# Altium schematic sheet [02]-STLinkV2_1.SchDoc (part 1 of 3)
size A4; Revision: 1.0; SheetNumber: 2; SheetTotal: 2
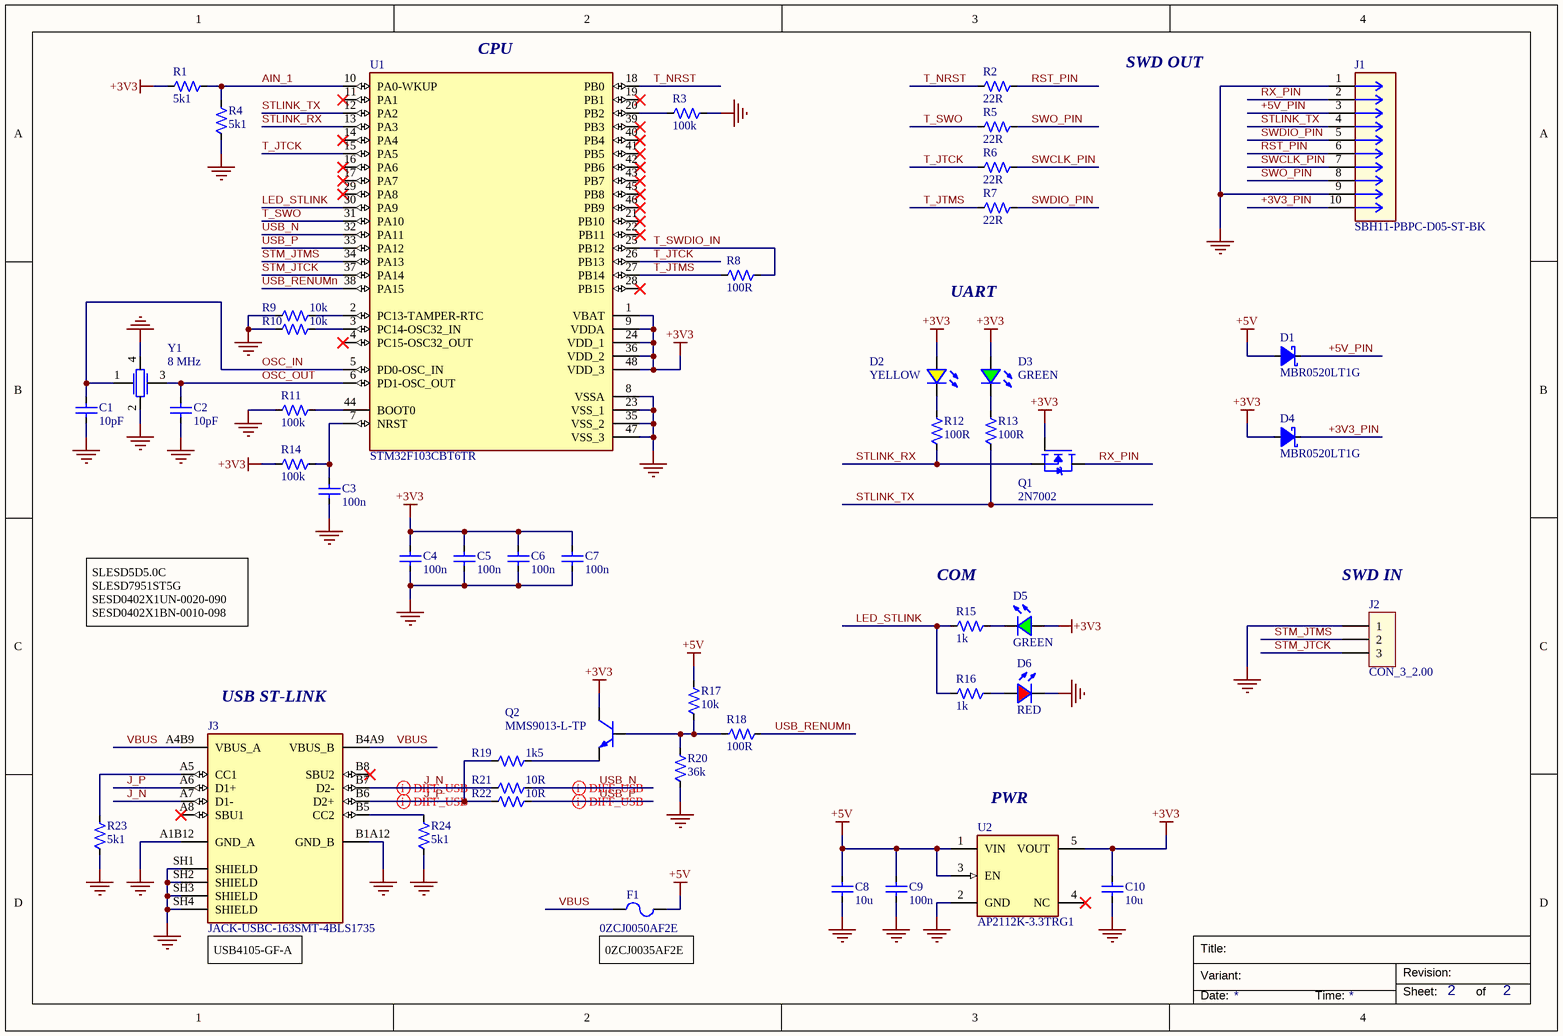
[diagram p0: [02]-STLinkV2_1.SchDoc]

## Parts
C1  10pF  [CAPC1005X55N]
C2  10pF  [CAPC1005X55N]
C3  100n  [CAPC1005X55N]
C4  100n  [CAPC1005X55N]
C5  100n  [CAPC1005X55N]
C6  100n  [CAPC1005X55N]
C7  100n  [CAPC1005X55N]
C8  10u  [CAPC0603(1608Metric)L]
C9  100n  [CAPC1005X55N]
C10  10u  [CAPC0603(1608Metric)L]
D1  MBR0520LT1G  [SOD3716X135N]
D2  YELLOW  [WL-SMCW_0603_150060xx75003]
D3  GREEN  [WL-SMCW_0603_150060xx75003]
D4  MBR0520LT1G  [SOD3716X135N]
D5  GREEN  [WL-SMCW_0603_150060xx75003]
D6  RED
F1  0ZCJ0050AF2E  [0ZCJ_BEL]
J1  SBH11-PBPC-D05-ST-BK  [SULLINS_SBH11-PBPC-D05-ST-BK-H]
J2  CON_3_2.00  [Pin3]  (no BOM)
J3  JACK-USBC-163SMT-4BLS1735  [JACK-USBC-163SMT-4BLS1735]
Q1  2N7002  [SOT23-3]
Q2  MMS9013-L-TP  [SOT23-3]
R1  5k1  [RESC1005X37N]
R2  22R  [RESC1005X37N]
R3  100k  [RESC1005X37N]
R4  5k1  [RESC1005X37N]
R5  22R  [RESC1005X37N]
R6  22R  [RESC1005X37N]
R7  22R  [RESC1005X37N]
R8  100R  [RESC1005X37N]
R9  10k  [RESC1005X37N]
R10  10k  [RESC1005X37N]
R11  100k  [RESC1005X37N]
R12  100R  [RESC1005X37N]
R13  100R  [RESC1005X37N]
R14  100k  [RESC1005X37N]
R15  1k  [RESC1005X37N]
R16  1k  [RESC1005X37N]
R17  10k  [RESC1005X37N]
R18  100R  [RESC1005X37N]
R19  1k5  [RESC1005X37N]
R20  36k  [RESC1005X37N]
R21  10R  [RESC1005X37N]
R22  10R  [RESC1005X37N]
R23  5k1  [RESC1005X37N]
R24  5k1  [RESC1005X37N]
U1  STM32F103CBT6TR  [QFP50P900X900X160-48N]
U2  AP2112K-3.3TRG1  [SOT95P285X140-5N]
Y1  value 8 MHz  [XTAL_C3E-8.000-8-1015-R]  (hidden comment: ECS-80-10-33-CKM-TR3)

## Nets
+3V3: C4.1 C5.1 C6.1 C7.1 C10.2 D2.1(POS) D3.1(POS) D4.1(A) D5.1(POS) Q1.1(G) Q2.3(C) R1.2 R14.2 U1.1(VBAT) U1.9(VDDA) U1.24(VDD_1) U1.36(VDD_2) U1.48(VDD_3) U2.5(VOUT)
+5V: C8.2 C9.1 D1.1(A) F1.2 R17.1 U2.1(VIN) U2.3(EN)
GND: C1.1 C2.1 C3.2 C4.2 C5.2 C6.2 C7.2 C8.1 C9.2 C10.1 D6.2(NEG) J1.1 J1.9 J2.1 J3.A1B12(GND_A) J3.B1A12(GND_B) J3.SH1(SHIELD) J3.SH2(SHIELD) J3.SH3(SHIELD) J3.SH4(SHIELD) R3.1 R4.2 R9.2 R10.2 R11.2 R20.2 R23.2 R24.2 U1.8(VSSA) U1.23(VSS_1) U1.35(VSS_2) U1.47(VSS_3) U2.2(GND) Y1.2(GND) Y1.4(GND)
+3V3_PIN: D4.2(K) J1.10
+5V_PIN: D1.2(K) J1.3
AIN_1: R1.1 R4.1 U1.10(PA0-WKUP)
J_N: J3.A7(D1-) J3.B7(D2-) R21.2
J_P: J3.A6(D1+) J3.B6(D2+) R19.2 R22.2
LED_STLINK: R15.2 R16.2 U1.30(PA9)
OSC_IN: C1.2 U1.5(PD0-OSC_IN) Y1.1
OSC_OUT: C2.2 U1.6(PD1-OSC_OUT) Y1.3
RST_PIN: J1.6 R2.1
RX_PIN: J1.2 Q1.3(D)
STLINK_RX: Q1.2(S) R12.2 U1.13(PA3)
STLINK_TX: J1.4 R13.2 U1.12(PA2)
STM_JTCK: J2.3 U1.37(PA14)
STM_JTMS: J2.2 U1.34(PA13)
SWCLK_PIN: J1.7 R6.1
SWDIO_PIN: J1.5 R7.1
SWO_PIN: J1.8 R5.1
T_JTCK: R6.2 U1.15(PA5) U1.26(PB13)
T_JTMS: R7.2 R8.2 U1.27(PB14)
T_NRST: R2.2 U1.18(PB0)
T_SWDIO_IN: R8.1 U1.25(PB12)
T_SWO: R5.2 U1.31(PA10)
USB_N: R21.1 U1.32(PA11)
USB_P: R22.1 U1.33(PA12)
USB_RENUMn: R18.2 U1.38(PA15)
VBUS: F1.1 J3.A4B9(VBUS_A) J3.B4A9(VBUS_B)
NetC3_1: C3.1 R14.1 U1.7(NRST)
NetD2_2: D2.2(NEG) R12.1
NetD3_2: D3.2(NEG) R13.1
NetD5_2: D5.2(NEG) R15.1
NetD6_1: D6.1(POS) R16.1
NetJ3_A5: J3.A5(CC1) R23.1
NetJ3_B5: J3.B5(CC2) R24.1
NetQ2_1: Q2.1(B) R17.2 R18.1 R20.1
NetQ2_2: Q2.2(E) R19.1
NetR3_2: R3.2 U1.20(PB2)
NetR9_1: R9.1 U1.2(PC13-TAMPER-RTC)
NetR10_1: R10.1 U1.3(PC14-OSC32_IN)
NetR11_1: R11.1 U1.44(BOOT0)

Not connected (* = marked no-connect by the designer): J3 A8(SBU1)* B8(SBU2)*; U1 4(PC15-OSC32_OUT)* 11(PA1)* 14(PA4)* 16(PA6)* 17(PA7)* 19(PB1)* 21(PB10)* 22(PB11)* 28(PB15)* 29(PA8)* 39(PB3)* 40(PB4)* 41(PB5)* 42(PB6)* 43(PB7)* 45(PB8)* 46(PB9)*; U2 4(NC)*

## Layout directives
differential pair; differential pair class USB: J_N, J_P, USB_N
differential pair; differential pair class DIFF_USB: USB_P

## Notes on the sheet
- (near U1) CPU
- SWD OUT
- UART
- (near R15) COM
- (near J2) SWD IN
- SLESD5D5.0C
  SLESD7951ST5G
  SESD0402X1UN-0020-090
  SESD0402X1BN-0010-098
- (near J3) USB ST-LINK
- (near U2) PWR
- (near J3) USB4105-GF-A
- (near F1) 0ZCJ0035AF2E
- Title:
- Variant:
- Revision:
- Date:
- Time:
- Sheet:
- of